# EAGLE design ESP12E_Si7021_meteostation (EAGLE 7.6.0)
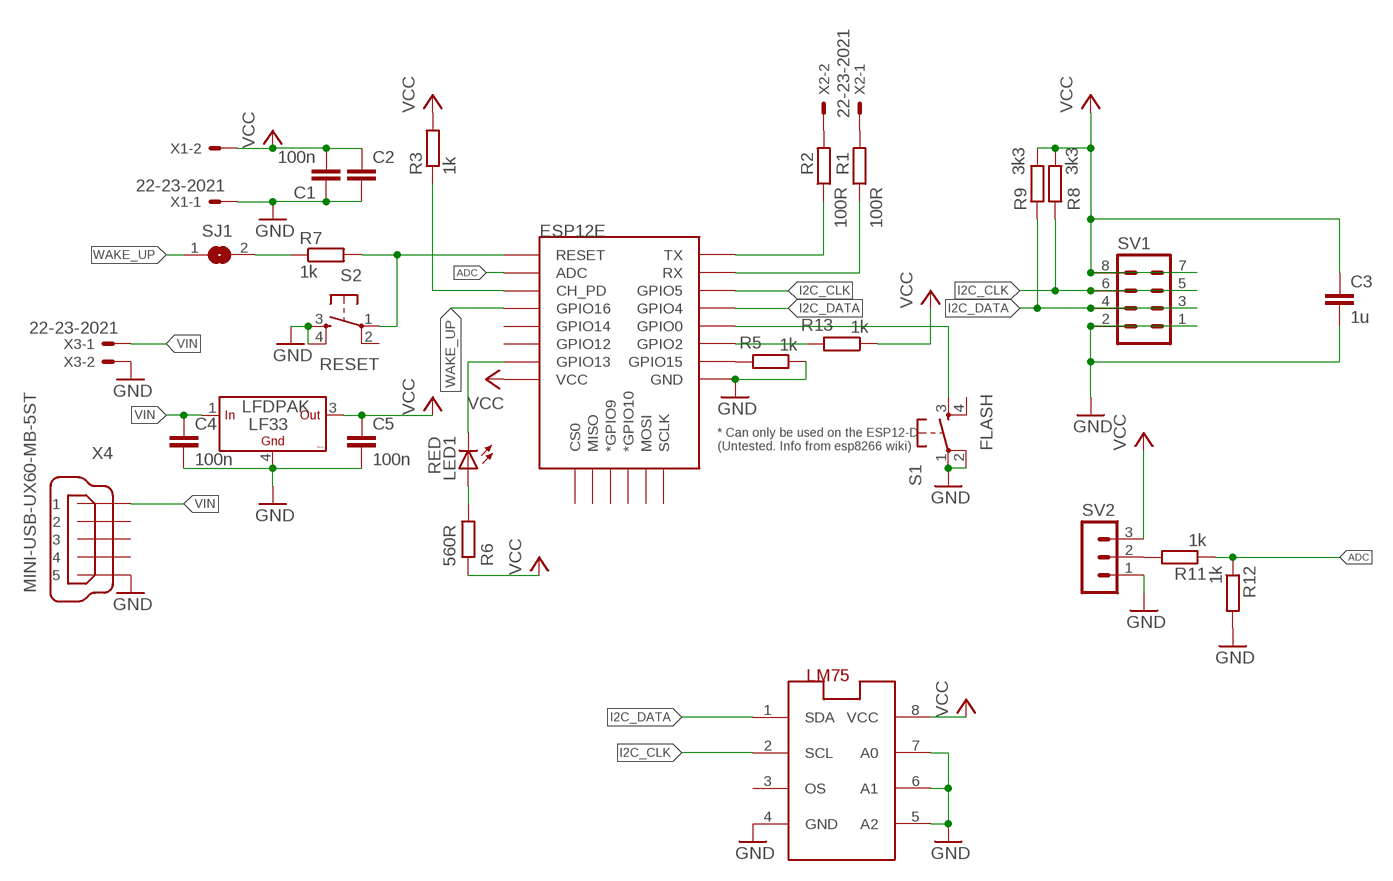
[diagram p0: schematic, sheet 1]

## Parts
C1  100n  C-EUC3225  [C3225]
C2  C-EUC1206  [C1206]
C3  1u  C-EUC1206  [C1206]
C4  100n  C-EUC1206  [C1206]
C5  100n  C-EUC1206  [C1206]
ESP12E  ESP12ESMD  [ESP12E-SMD]
LED1  RED  LEDCHIPLED_0603  [CHIPLED_0603]
LF33  LFDPAK  LFDPAKDPAKC  [DPAK]
LM75  LM75_ICN  [SO8_LM75]
R1  100R  R-EU_R0805  [R0805]
R2  100R  R-EU_R0805  [R0805]
R3  1k  R-EU_R1206  [R1206]
R5  1k  R-EU_R0805  [R0805]
R6  560R  R-EU_R0805  [R0805]
R7  1k  R-EU_R0805  [R0805]
R8  3k3  R-EU_R0805  [R0805]
R9  3k3  R-EU_R0805  [R0805]
R11  1k  R-EU_M0805  [M0805]
R12  1k  R-EU_M0805  [M0805]
R13  1k  R-EU_R0805  [R0805]
S1  FLASH  TAC_SWITCHPTH  [TACTILE-PTH]
S2  RESET  TAC_SWITCHPTH  [TACTILE-PTH]
SJ1  SJ  [SJ]
SV1  MA04-2  [MA04-2]
SV2  MA03-1  [MA03-1]
X1  22-23-2021  [22-23-2021]
X2  22-23-2021  [22-23-2021]
X3  22-23-2021  [22-23-2021]
X4  MINI-USB-UX60-MB-5ST  [UX60-MB-5ST]

## Nets
ADC: ESP12E.ADC R11.1 R12.1
GND: C1.1 C2.2 C3.2 C4.2 C5.2 ESP12E.GND LF33.4(GND) LM75.4(GND) LM75.5(A2) LM75.6(A1) LM75.7(A0) R5.1 R12.2 S1.1 S1.2 S2.3 S2.4 SV1.1 SV1.2 SV2.1 X1.1 X3.2 X4.5
I2C_CLK: ESP12E.GPIO5 LM75.2(SCL) R8.1 SV1.5 SV1.6
I2C_DATA: ESP12E.GPIO4 LM75.1(SDA) R9.1 SV1.3 SV1.4
N$1: R1.2 X2.1
N$2: R2.2 X2.2
N$3: ESP12E.RXD0(RX) R1.1
N$4: ESP12E.TXD0(TX) R2.1
N$5: ESP12E.RESET R7.2 S2.1
N$6: ESP12E.GPIO15 R5.2
N$7: ESP12E.CH_PD R3.1
N$8: LED1.A R6.2
N$9: ESP12E.GPIO13 LED1.C
N$10: R7.1 SJ1.2
N$11: ESP12E.GPIO2 R13.2
N$12: ESP12E.GPIO0 S1.3
N$13: R11.2 SV2.2
VCC: C1.2 C2.1 C3.1 C5.1 ESP12E.VCC LF33.3(OUT) LM75.8(VCC) R3.2 R6.1 R8.2 R9.2 R13.1 SV1.7 SV1.8 SV2.3 X1.2
VIN: C4.1 LF33.1(IN) X3.1 X4.1
WAKE_UP: ESP12E.GPIO16 SJ1.1
Unconnected: ESP12E.CS0 ESP12E.GPIO9(*GPIO9) ESP12E.GPIO10(*GPIO10) ESP12E.GPIO12 ESP12E.GPIO14 ESP12E.MISO ESP12E.MOSI ESP12E.SCLK LM75.3(OS) S1.4 S2.2 X4.2 X4.3 X4.4

## Library data of the parts
C1-C5 = rcl:C-EU: CAPACITOR, European symbol
ESP12E = esp8266modules:ESP12E: ESP12E Module
LED1 = led:LED: LED OSRAM: - CHIPLED LG R971, LG N971, LY N971, LG Q971, LY Q971, LO R971, LY R971 LH N974, LH R974 LS Q976, LO Q976, LY Q976 LO Q996 - Hyper CHIPLED LW Q18S LB Q993, LB Q99A, LB R99A - SideLED LS A670, LO A670, LY A670, LG A670, LP A670 LB A673, LV A673, LT A673, LW A673 LH A674 LY A675 LS A676, LA A676, LO A676, LY A676, LW A676 LS A679, LY A679, LG A679 - Hyper Micro SIDELED® LS Y876, LA Y876, LO Y876, LY Y876 LT Y87S - SmartLED LW L88C, LW L88S LB L89C, LB L89S, LG L890 LS L89K, LO L89K, LY L89K LS L896, LA L896, LO L896, LY L896 - TOPLED LS T670, LO T670, LY T670, LG T670, LP T670 LSG T670, LSP T670, LSY T670, LOP T670, LYG T670 LG T671, LOG T671, LSG T671 LB T673, LV T673, LT T673, LW T673 LH T674 LS T676, LA T676, LO T676, LY T676, LB T676, LH T676, LSB T676, LW T676 LB T67C, LV T67C, LT T67C, LS T67K, LO T67K, LY T67K, LW E67C LS E67B, LA E67B, LO E67B, LY E67B, LB E67C, LV E67C, LT E67C LW T67C LS T679, LY T679, LG T679 LS T770, LO T770, LY T770, LG T770, LP T770 LB T773, LV T773, LT T773, LW T773 LH T774 LS E675, LA E675, LY E675, LS T675 LS T776, LA T776, LO T776, LY T776, LB T776 LHGB T686 LT T68C, LB T68C - Hyper Mini TOPLED® LB M676 - Mini TOPLED Santana® LG M470 LS M47K, LO M47K, LY M47K Source: http://www.osram.convergy.de LUXEON: - LUMILED® LXK2-PW12-R00, LXK2-PW12-S00, LXK2-PW14-U00, LXK2-PW14-V00 LXK2-PM12-R00, LXK2-PM12-S00, LXK2-PM14-U00 LXK2-PE12-Q00, LXK2-PE12-R00, LXK2-PE12-S00, LXK2-PE14-T00, LXK2-PE14-U00 LXK2-PB12-K00, LXK2-PB12-L00, LXK2-PB12-M00, LXK2-PB14-N00, LXK2-PB14-P00, LXK2-PB14-Q00 LXK2-PR12-L00, LXK2-PR12-M00, LXK2-PR14-Q00, LXK2-PR14-R00 LXK2-PD12-Q00, LXK2-PD12-R00, LXK2-PD12-S00 LXK2-PH12-R00, LXK2-PH12-S00 LXK2-PL12-P00, LXK2-PL12-Q00, LXK2-PL12-R00 Source: www.luxeon.com KINGBRIGHT: KA-3528ASYC Source: www.kingbright.com
LF33 = #PaJa_30:LF??C: LF??C - stabilizátory low-drop výstup dle typu 1,25 - 12V
LM75 = lm75:LM75_IC: Temperatursensor
R1-R3 R5-R9 R11-R13 = rcl:R-EU_: RESISTOR, European symbol
S1 S2 = SparkFun:TAC_SWITCH: Momentary Switch Button commonly used for reset or general input. Spark Fun Electronics SKU : COM-00097
SJ1 = jumper:SJ: SMD solder JUMPER
SV1 = con-lstb:MA04-2: PIN HEADER; OC_FARNELL: unknown; OC_NEWARK: unknown
SV2 = con-lstb:MA03-1: PIN HEADER; OC_FARNELL: unknown; OC_NEWARK: unknown
X1-X3 = con-molex:22-23-2021: .100" (2.54mm) Center Header - 2 Pin; MF: MOLEX; MPN: 22-23-2021; OC_FARNELL: 1462926; OC_NEWARK: 25C3832
X4 = con-hirose:MINI-USB-: MINI USB Connector Source: http://www.hirose.co.jp/cataloge_hp/e24000019.pdf; OC_FARNELL: unknown; OC_NEWARK: unknown

## Board
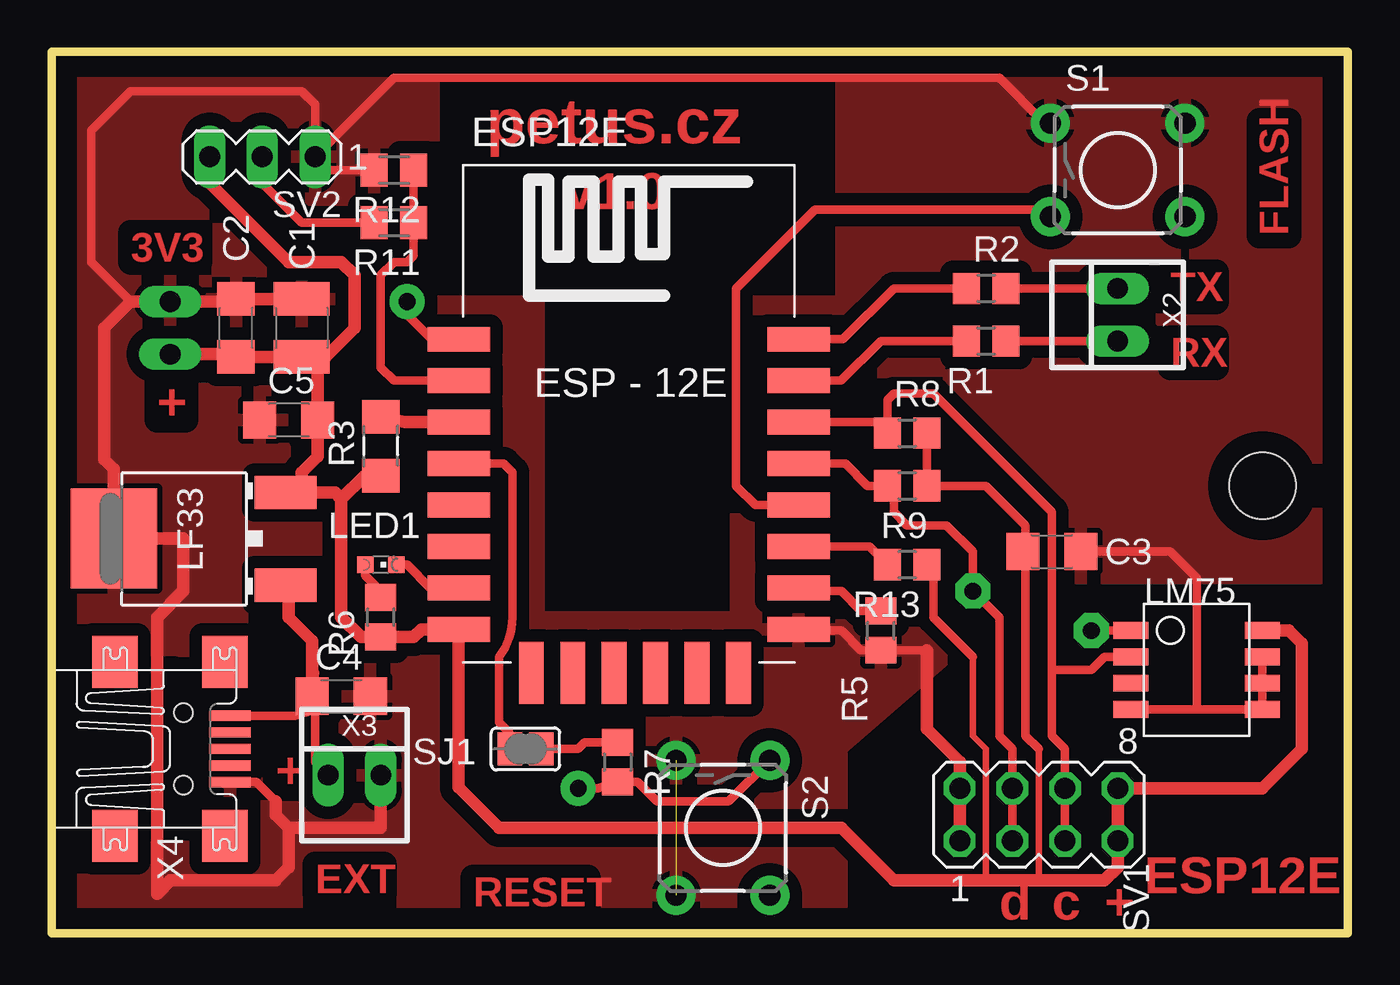
[diagram p1: board, top side]
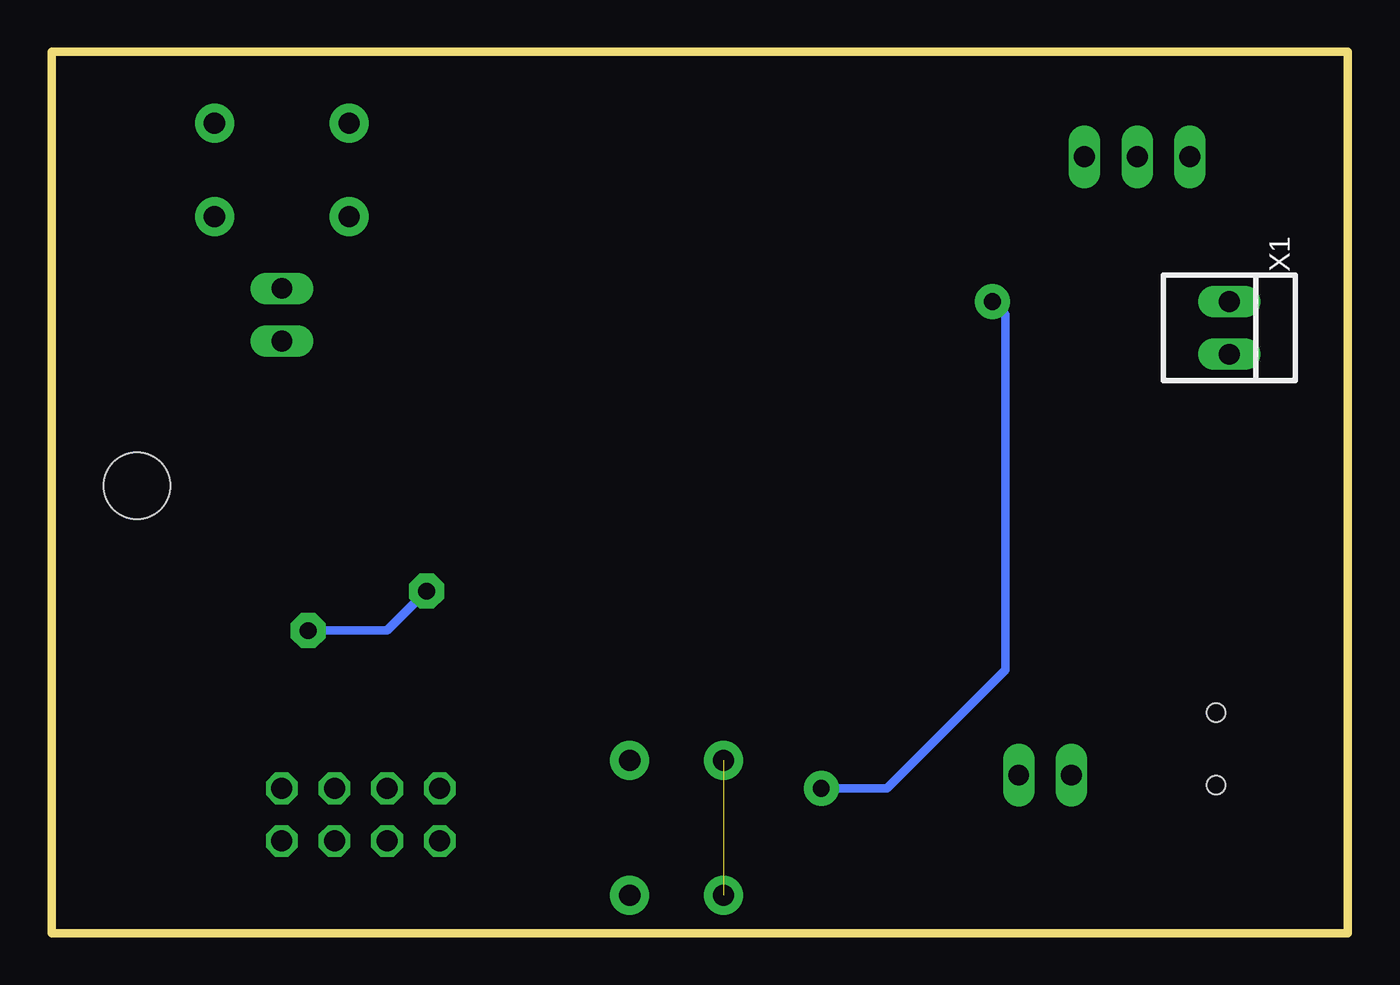
[diagram p2: board, bottom side, seen from below]

Size 62.53 x 42.53 mm. Coordinates in mm from the lower left corner, seen from the top.
Outline: 0,0 62.53,0 62.53,42.53 0,42.53 0,0
Copper layers (1*16): Top 0.035mm / dielectric 1.5mm / Bottom 0.035mm
Design rules "default *": minimum track width 10mil, minimum drill 24mil, track to track 8mil, track to pad 8mil, pad to pad 8mil, via to via 8mil, smd to smd 8mil, copper to edge 40mil, drill to drill 8mil, minimum pad ring 10mil, minimum via ring 8mil, stop-mask expansion 4mil, vias tented up to drill 0mil, thermal gap 10mil
Holes 3.2 mm at 58.42,21.59

### Footprints (pad centres in the part's own frame; a part is rotated, then mirrored left to right if it is on the bottom)
C3225 = smd 1.6 x 2.7: 1 -1.4,0; 2 1.4,0
C1206 = smd 1.6 x 1.8: 1 -1.4,0; 2 1.4,0
ESP12E-SMD = smd 3 x 1.2: ADC -8.3,3.8; CH_PD -8.3,1.8; GND 8.1,-8.2; GPIO0 8.1,-2.2; GPIO2 8.1,-4.2; GPIO4 8.1,-0.2; GPIO5 8.1,1.8; GPIO12 -8.3,-4.2; GPIO13 -8.3,-6.2; GPIO14 -8.3,-2.2; GPIO15 8.1,-6.2; GPIO16 -8.3,-0.2; RESET -8.3,5.8; RXD0 8.1,3.8; TXD0 8.1,5.8; VCC -8.3,-8.2 | smd 1.2 x 3: CS0 -4.8,-10.3; GPIO9 -0.8,-10.3; GPIO10 1.2,-10.3; MISO -2.8,-10.3; MOSI 3.2,-10.3; SCLK 5.2,-10.3
CHIPLED_0603 = smd 0.8 x 0.8: A 0,-0.75; C 0,0.75
DPAK = smd 1.6 x 2.997: 1 -2.261,-4.928; 3 2.21,-4.928 | smd 4.826 x 4.191: 4 0,3.353
SO8_LM75 = smd 0.813 x 1.676: 1 -1.27,-3.175; 2 0,-3.175; 3 1.27,-3.175; 4 2.54,-3.175; 5 2.54,3.175; 6 1.27,3.175; 7 0,3.175; 8 -1.27,3.175
R0805 = smd 1.3 x 1.5: 1 -0.95,0; 2 0.95,0
R1206 = smd 1.6 x 1.803: 1 -1.422,0; 2 1.422,0
M0805 = smd 1.3 x 1.6: 1 -0.95,0; 2 0.95,0
TACTILE-PTH = drill 1.016 pad 1.88: 1 -3.251,2.261; 2 3.251,2.261; 3 -3.251,-2.261; 4 3.251,-2.261
SJ = smd 1.168 x 1.6: 1 -0.762,0; 2 0.762,0
MA04-2 = drill 1.016 octagon: 1 -3.81,-1.27; 2 -3.81,1.27; 3 -1.27,-1.27; 4 -1.27,1.27; 5 1.27,-1.27; 6 1.27,1.27; 7 3.81,-1.27; 8 3.81,1.27
MA03-1 = drill 1.016 long: 1 -2.54,0; 2 0,0; 3 2.54,0
22-23-2021 = drill 1 long: 1 -1.27,0; 2 1.27,0
UX60-MB-5ST = smd 2 x 0.5: 1 2.25,1.6; 2 2.25,0.8; 3 2.25,0; 4 2.25,-0.8; 5 2.25,-1.6 | smd 2.2 x 2.5: M1 -3.3,-4.2; M2 -3.3,4.2; M3 2,4.2; M4 2,-4.2 | hole 0.9: 0,-1.75; 0,1.75

### Placement (x,y rotation side)
C1  12.06,29.21 270 top
C2  8.89,29.21 90 top
C3  48.26,18.41 0 top
C4  13.97,11.43 0 top
C5  11.43,24.77 180 top
ESP12E  27.94,22.86 0 top
LED1  15.88,17.78 270 top
LF33  6.35,19.05 90 top
LM75  55.24,13.34 270 top
R1  45.09,28.57 0 top
R2  45.09,31.11 0 top
R3  15.88,23.5 270 top
R5  40.01,14.61 90 top
R6  15.88,15.24 90 top
R7  27.3,8.26 270 top
R8  41.27,24.13 0 top
R9  41.27,21.59 0 top
R11  16.51,34.29 180 top
R12  16.51,36.83 180 top
R13  41.27,17.78 180 top
S1  51.44,36.83 0 top
S2  32.38,5.08 270 top
SJ1  22.86,8.89 0 top
SV1  47.62,5.71 0 top
SV2  10.16,37.47 180 top
X1  5.71,29.21 270 bottom
X2  51.44,29.84 90 top
X3  14.61,7.62 0 top
X4  6.35,8.89 0 top

### Tracks (layer width: path | path; a pad name or v marks a point on that pad's centre or on a via)
ADC
  Top 0.406: R12.1 R11.1 17.46,32.7 17.14,32.38 16.51,32.38 15.88,31.75 15.88,27.3 16.51,26.67 ESP12E.ADC
GND  (1 unrouted)
  Top 0.406: LM75.7 LM75.6 LM75.5 55.24,10.79 | ESP12E.GND 36.09,14.61 38.1,14.61 39.05,13.65 R5.1 42.23,13.65 | SV2.1 12.7,40.01 12.06,40.64 3.81,40.64 1.91,38.73 1.91,32.38 3.81,30.48 | R12.2 13.34,36.83 SV2.1 | S1.1 47.9,39.09 45.72,41.27 16.51,41.27 SV2.1 | LM75.4 55.24,10.79 | 55.24,10.79 55.24,17.14 53.98,18.41 C3.2 | X4.5 9.86,7.29 10.79,6.35
  Top 0.61: 8.89,30.48 C2.2 9.53,30.61 | SV1.1 SV1.2 43.81,8.26 42.23,9.85 42.23,13.65 | 9.53,30.61 C1.1 | 9.53,30.61 9.39,30.48 X1.1 3.81,30.48 2.54,29.21 2.54,22.86 3,22.4 LF33.4 6.35,19.05 6.35,16.51 5.08,15.24 5.08,1.91 5.71,2.54 10.79,2.54 11.43,3.17 11.43,5.08 | X3.2 15.88,5.08 11.43,5.08 | 10.79,6.35 10.79,5.71 11.43,5.08
  pour Top (isolate 0.61): 0,43.18 18.41,43.18 18.41,30.48 23.5,30.48 23.5,15.24 33.02,15.24 33.02,30.48 38.1,30.48 38.1,43.18 62.87,43.18 62.87,17.14 47.62,17.14 38.1,8.89 38.1,0 0,0
I2C_CLK
  Top 0.406: SV1.5 SV1.6 48.9,8.89 48.26,9.53 48.26,12.7 | ESP12E.GPIO5 39.8,24.66 R8.1 40.33,25.72 40.64,26.04 42.55,26.04 48.26,20.32 48.26,12.7 | LM75.2 50.8,13.34 50.16,12.7 48.26,12.7
I2C_DATA  (via drill 0.8 pad 1.68)
  Top 0.406: SV1.3 SV1.4 46.35,8.89 45.72,9.53 45.72,15.24 v44.45,16.51 44.45,18.41 43.18,19.68 41.27,19.68 40.64,20.32 40.64,21.27 R9.1 39.37,21.59 38.3,22.66 ESP12E.GPIO4 | LM75.1 v50.16,14.61
  Bottom 0.406: v50.16,14.61 46.35,14.61 v44.45,16.51
N$1
  Top 0.406: X2.1 R1.2
N$2
  Top 0.406: X2.2 R2.2
N$3
  Top 0.406: ESP12E.RXD0 38.09,26.66 40.01,28.57 R1.1
N$4
  Top 0.406: ESP12E.TXD0 38.19,28.66 40.64,31.11 R2.1
N$5  (via drill 0.8 pad 1.68)
  Top 0.406: v25.4,6.99 26.35,6.99 R7.2 28.25,7.3 29.21,6.35 32.66,6.35 S2.1 | ESP12E.RESET 18.33,28.66 17.14,29.84 v17.14,30.48
  Bottom 0.406: v25.4,6.99 22.23,6.99 16.51,12.7 16.51,29.84 v17.14,30.48
N$6
  Top 0.406: R5.2 39.05,15.55 38.1,16.51 36.19,16.51 ESP12E.GPIO15
N$7
  Top 0.61: ESP12E.CH_PD 17.04,24.66 16.51,24.77 R3.1
N$8
  Top 0.406: LED1.A 15.12,17.26 15.88,16.51 R6.2
N$9
  Top 0.406: LED1.C 17.14,17.78 18.27,16.66 ESP12E.GPIO13
N$10
  Top 0.406: SJ1.2 25.4,8.89 25.71,9.21 R7.1
N$11
  Top 0.406: ESP12E.GPIO2 39.45,18.66 R13.2
N$12
  Top 0.406: ESP12E.GPIO0 33.95,20.66 33.02,21.59 33.02,31.11 36.83,34.92 47.83,34.92 S1.3
N$13
  Top 0.406: R11.2 12.06,34.29 10.16,36.2 SV2.2
VCC
  Top 0.305: 44.45,13.34 44.45,9.53 45.09,8.89 45.09,2.54 | 47.62,8.89 47.62,2.54
  Top 0.406: R13.1 42.55,17.14 42.55,15.24 44.45,13.34 | 47.62,8.89 46.99,9.53 46.99,18.41 46.86,17.91 C3.1 46.99,18.55 46.99,19.68 45.09,21.59 R9.2 R8.2 | C1.2 12.7,27.81 | 12.7,27.81 13.21,27.81 | R3.2 15.09,22.07 | 12.83,27.68 12.7,27.81
  Top 0.61: 8.89,27.94 C2.1 | C2.1 C1.2 | X1.2 8.76,27.94 C2.1 | LF33.3 12.06,21.26 | 12.06,21.26 13.66,21.26 13.97,20.95 | 13.97,20.95 13.97,15.24 14.92,14.29 R6.1 17.46,14.29 17.84,14.66 ESP12E.VCC 19.64,7.03 21.59,5.08 38.1,5.08 40.64,2.54 45.09,2.54 47.62,2.54 50.8,2.54 51.44,3.17 SV1.7 SV1.8 58.42,6.99 60.33,8.89 60.33,13.97 59.69,14.61 LM75.8 | 13.21,27.81 14.61,29.21 14.61,31.11 14.61,31.75 13.97,32.38 11.43,32.38 7.62,36.2 SV2.3 | 12.06,21.26 12.06,22.23 12.83,22.99 C5.1 12.83,27.68 | 15.09,22.07 13.97,20.95
VIN
  Top 0.406: X4.1 11.73,10.49 12.7,10.79 | 12.7,12.57 C4.1 12.7,11.94 12.7,10.79 | X3.1 12.7,8.26 12.7,10.79
  Top 0.61: C4.1 12.57,14.1 11.43,15.24 11.43,16.64 LF33.1
WAKE_UP
  Top 0.406: SJ1.1 22.1,9.65 21.59,10.16 21.59,13.34 arc37 22.23,15.24 22.23,22.23 21.79,22.66 ESP12E.GPIO16

### Text on the board
Top: petus.cz | v1.0 | FLASH | 3V3 | TX | RX | + | + | EXT | ESP12E | RESET | d | c | +